# EAGLE design NMEA-v8.2-iso (EAGLE 6.4)
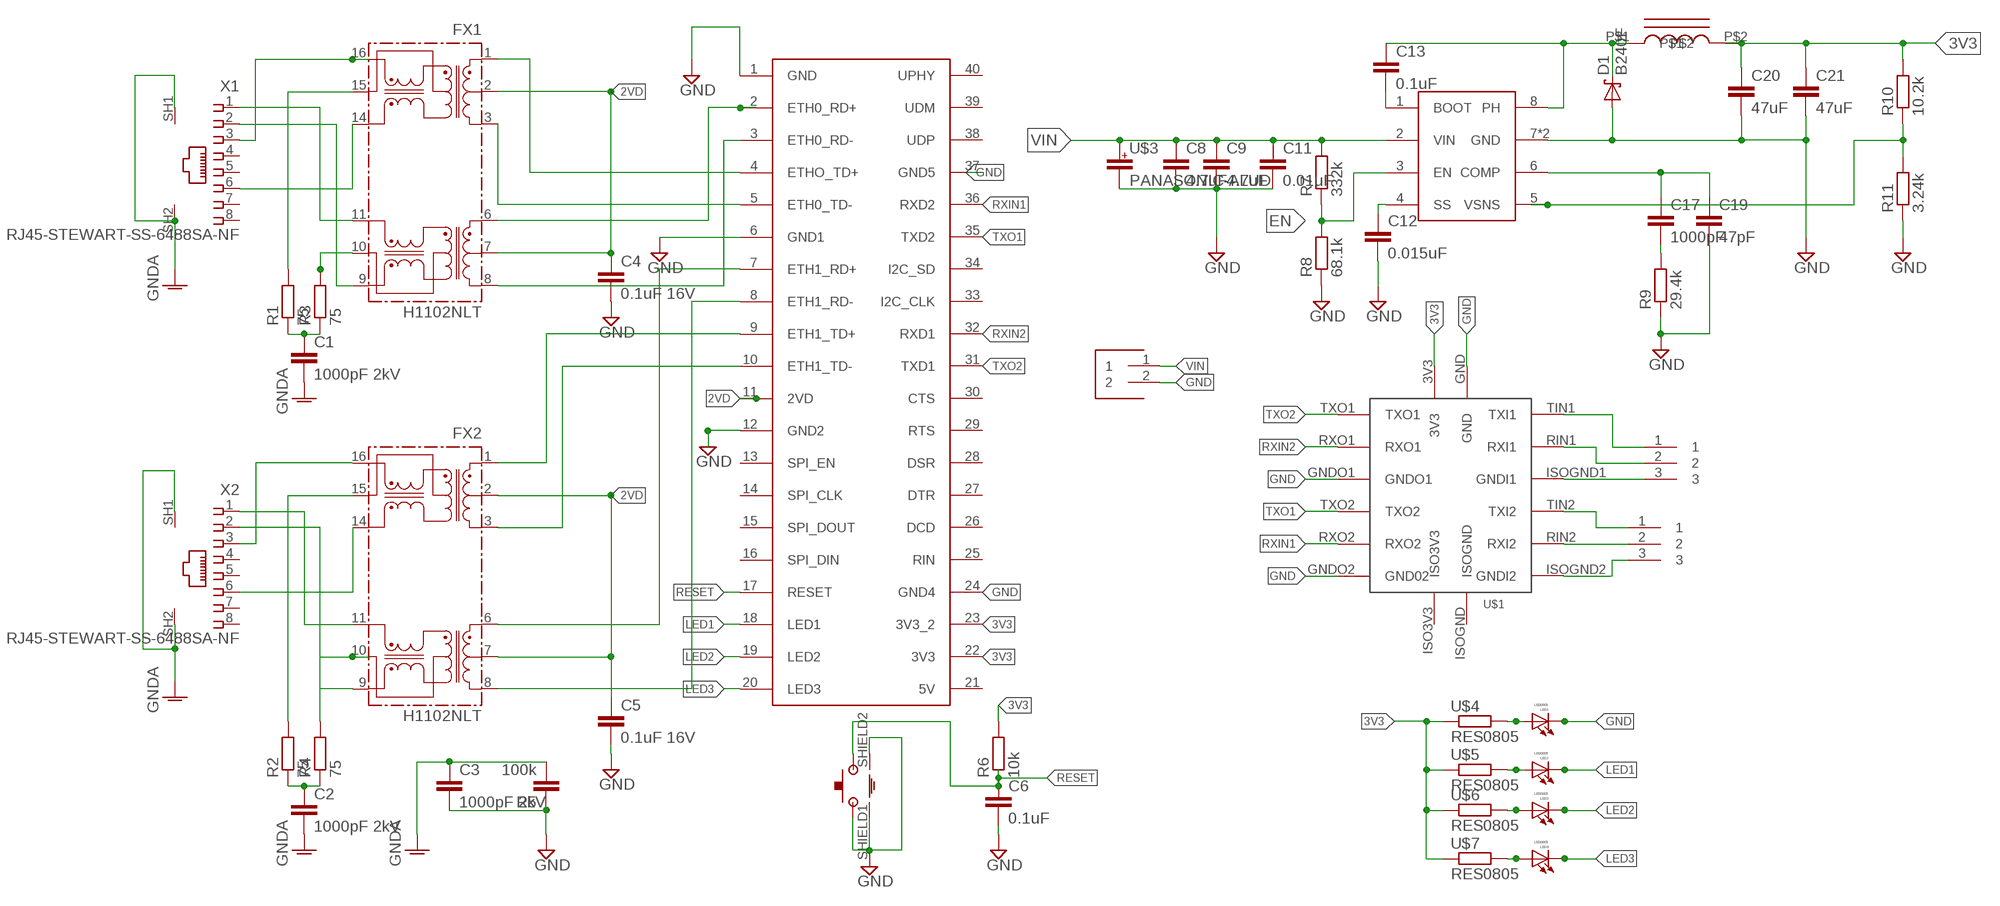
[diagram p0: schematic, sheet 1]

## Parts
C1  1000pF 2kV  CAP1206  [1206]
C2  1000pF 2kV  CAP1206  [1206]
C3  1000pF 2kV  CAP1206  [1206]
C4  0.1uF 16V  CAP0805  [0805]
C5  0.1uF 16V  CAP0805  [0805]
C6  0.1uF  CAP0805  [0805]
C8  4.7uF  CAP1210  [1210]
C9  4.7uF  CAP1210  [1210]
C11  0.01uF  CAP0805  [0805]
C12  0.015uF  CAP0805  [0805]
C13  0.1uF  CAP0805  [0805]
C17  1000pF  CAP0805  [0805]
C19  47pF  CAP0805  [0805]
C20  47uF  CAP1206  [1206]
C21  47uF  CAP1206  [1206]
CARAMBOLA  CARAMBOLA  [CARAMBOLA]
D1  B240F  [SMB]
DATA1  CON-3  [CON-3]
DATA2  CON-3  [CON-3]
FX1  H1102NLT  [H/HX1XXXNL]
FX2  H1102NLT  [H/HX1XXXNL]
J1  CON-5MM-2  [CON--5MM-2]
L1  CLF_TDK_INDUCTORCLF10040  [CLF10040]
LED1  LED0805  [L0805]
LED2  LED0805  [L0805]
LED3  LED0805  [L0805]
LED4  LED0805  [L0805]
R1  75  RES0805  [0805]
R2  75  RES0805  [0805]
R3  75  RES0805  [0805]
R4  75  RES0805  [0805]
R5  100k  CAP1206  [1206]
R6  10k  RES0805  [0805]
R7  332k  RES0805  [0805]
R8  68.1k  RES0805  [0805]
R9  29.4k  RES0805  [0805]
R10  10.2k  RES0805  [0805]
R11  3.24k  RES0805  [0805]
U8  TPS54231  [SOIC-THERMAL]
U$1  ISO-BOARDV1  [ISO-BOARD]
U$2  TACTILE-SWITCH-FSMRA1J  [TACTILE-SWITCH-FSMRA1J]
U$3  PANASONIC-ALUD  [PANASONIC_D]
U$4  RES0805  [0805]
U$5  RES0805  [0805]
U$6  RES0805  [0805]
U$7  RES0805  [0805]
X1  RJ45-STEWART-SS-6488SA-NF  [RJ45-STEWART-6488]
X2  RJ45-STEWART-SS-6488SA-NF  [RJ45-STEWART-6488]

## Nets
2VD: C4.1 C5.1 CARAMBOLA.11(2VD) FX1.2 FX1.7 FX2.2 FX2.7
3V3: C20.1 C21.1 CARAMBOLA.22(3V3) CARAMBOLA.23(3V3_2) L1.P$2 R6.2 R10.2 U$1.3V3 U$4.1 U$5.1 U$6.1 U$7.1
EN: R7.1 R8.2 U8.3(EN)
ETH1_RD: CARAMBOLA.8(ETH1_RD-) FX2.8
GND: C3.2 C4.2 C5.2 C6.2 C8.2 C9.2 C11.2 C12.2 C19.2 C20.2 C21.2 CARAMBOLA.1(GND) CARAMBOLA.6(GND1) CARAMBOLA.12(GND2) CARAMBOLA.24(GND4) CARAMBOLA.37(GND5) D1.A J1.2 LED1.C R5.1 R8.1 R9.1 R11.1 U8.7(GND) U8.P$1(GND) U$1.GND U$1.GNDO1 U$1.GNDO2(GND02) U$2.2 U$2.SHIELD1 U$2.SHIELD2 U$3.-
GNDA: C1.2 C2.2 C3.1 R5.2 X1.SH1 X1.SH2 X2.SH1 X2.SH2
ISOGND1: DATA1.3 U$1.ISOGND1(GNDI1)
ISOGND2: DATA2.3 U$1.ISOGND2(GNDI2)
LED1: CARAMBOLA.18(LED1) LED2.C
LED2: CARAMBOLA.19(LED2) LED3.C
LED3: CARAMBOLA.20(LED3) LED4.C
N$1: CARAMBOLA.4(ETHO_TD+) FX1.1
N$2: C13.2 U8.1(BOOT)
N$3: LED1.A U$4.2
N$4: LED2.A U$5.2
N$5: LED3.A U$6.2
N$6: R10.1 R11.2 U8.5(VSNS)
N$7: C17.1 C19.1 U8.6(COMP)
N$8: C17.2 R9.2
N$9: LED4.A U$7.2
N$11: CARAMBOLA.2(ETH0_RD+) FX1.6
N$13: CARAMBOLA.5(ETH0_TD-) FX1.3
N$16: CARAMBOLA.3(ETH0_RD-) FX1.8
N$17: C2.1 R2.1 R4.1
N$20: FX1.10 R3.2
N$21: FX1.15 R1.2
N$22: C1.1 R1.1 R3.1
N$23: FX1.11 X1.1
N$24: FX1.9 X1.2
N$25: FX1.16 X1.3
N$26: FX1.14 X1.6
N$27: CARAMBOLA.7(ETH1_RD+) FX2.6
N$28: CARAMBOLA.9(ETH1_TD+) FX2.1
N$30: CARAMBOLA.10(ETH1_TD-) FX2.3
N$31: FX2.15 R2.2
N$32: FX2.10 R4.2
N$33: FX2.16 X2.3
N$34: FX2.11 X2.1
N$35: FX2.14 X2.6
N$36: FX2.9 X2.2
PH: C13.1 D1.C L1.P$1 U8.8(PH)
RESET: C6.1 CARAMBOLA.17(RESET) R6.1 U$2.1
RIN1: DATA1.2 U$1.RIN1(RXI1)
RIN2: DATA2.2 U$1.RIN2(RXI2)
RXIN1: CARAMBOLA.36(RXD2) U$1.RXO2
RXIN2: CARAMBOLA.32(RXD1) U$1.RXO1
SS: C12.1 U8.4(SS)
TIN1: DATA1.1 U$1.TIN1(TXI1)
TIN2: DATA2.1 U$1.TIN2(TXI2)
TXO1: CARAMBOLA.35(TXD2) U$1.TXO2
TXO2: CARAMBOLA.31(TXD1) U$1.TXO1
VIN: C8.1 C9.1 C11.1 J1.1 R7.2 U8.2(VIN) U$3.+
Unconnected: CARAMBOLA.13(SPI_EN) CARAMBOLA.14(SPI_CLK) CARAMBOLA.15(SPI_DOUT) CARAMBOLA.16(SPI_DIN) CARAMBOLA.21(5V) CARAMBOLA.25(RIN) CARAMBOLA.26(DCD) CARAMBOLA.27(DTR) CARAMBOLA.28(DSR) CARAMBOLA.29(RTS) CARAMBOLA.30(CTS) CARAMBOLA.33(I2C_CLK) CARAMBOLA.34(I2C_SD) CARAMBOLA.38(UDP) CARAMBOLA.39(UDM) CARAMBOLA.40(UPHY) U$1.ISO3V3 U$1.ISOGND X1.4 X1.5 X1.7 X1.8 X2.4 X2.5 X2.7 X2.8

## Library data of the parts
C1-C6 C8 C9 C11-C13 C17 C19-C21 R5 = __bo_caps:CAP
CARAMBOLA = __my:CARAMBOLA
D1 = __my:B240
DATA1 DATA2 = __my:CON-3
FX1 FX2 = __my:H1102NLT
J1 = __my:CON-5MM-2
L1 = __my:CLF_TDK_INDUCTOR
LED1-LED4 = __my:LED: High Luminous Efficacy 3W Warm White LED Emitter Source: http://www.ledengin.com/products/3wLZ/LZ1-00WW03.pdf
R1-R4 R6-R11 U$4-U$7 = __bo_caps:RES
U8 = __my:TPS54231
U$1 = __my:ISO-BOARD
U$2 = __my:TACTILE-SWITCH-FSMRA
U$3 = __bo_caps:PANASONIC-ALU
X1 X2 = __my:RJ45-STEWART-SS-6488S

## Board
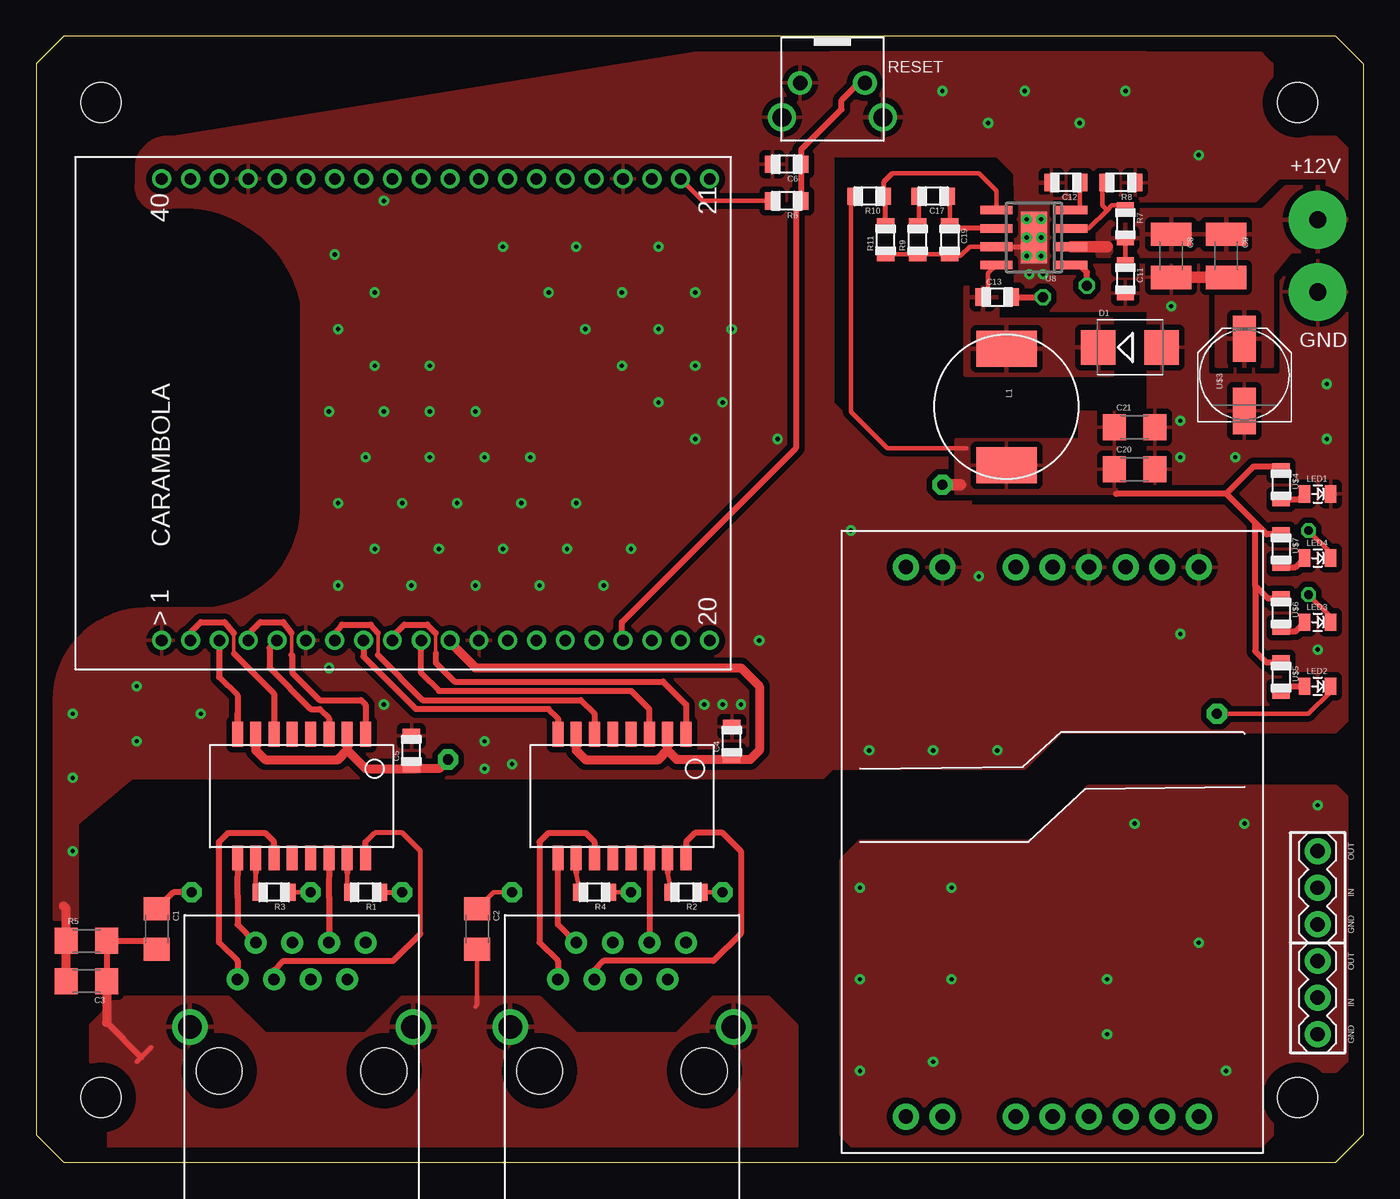
[diagram p1: board, top side]
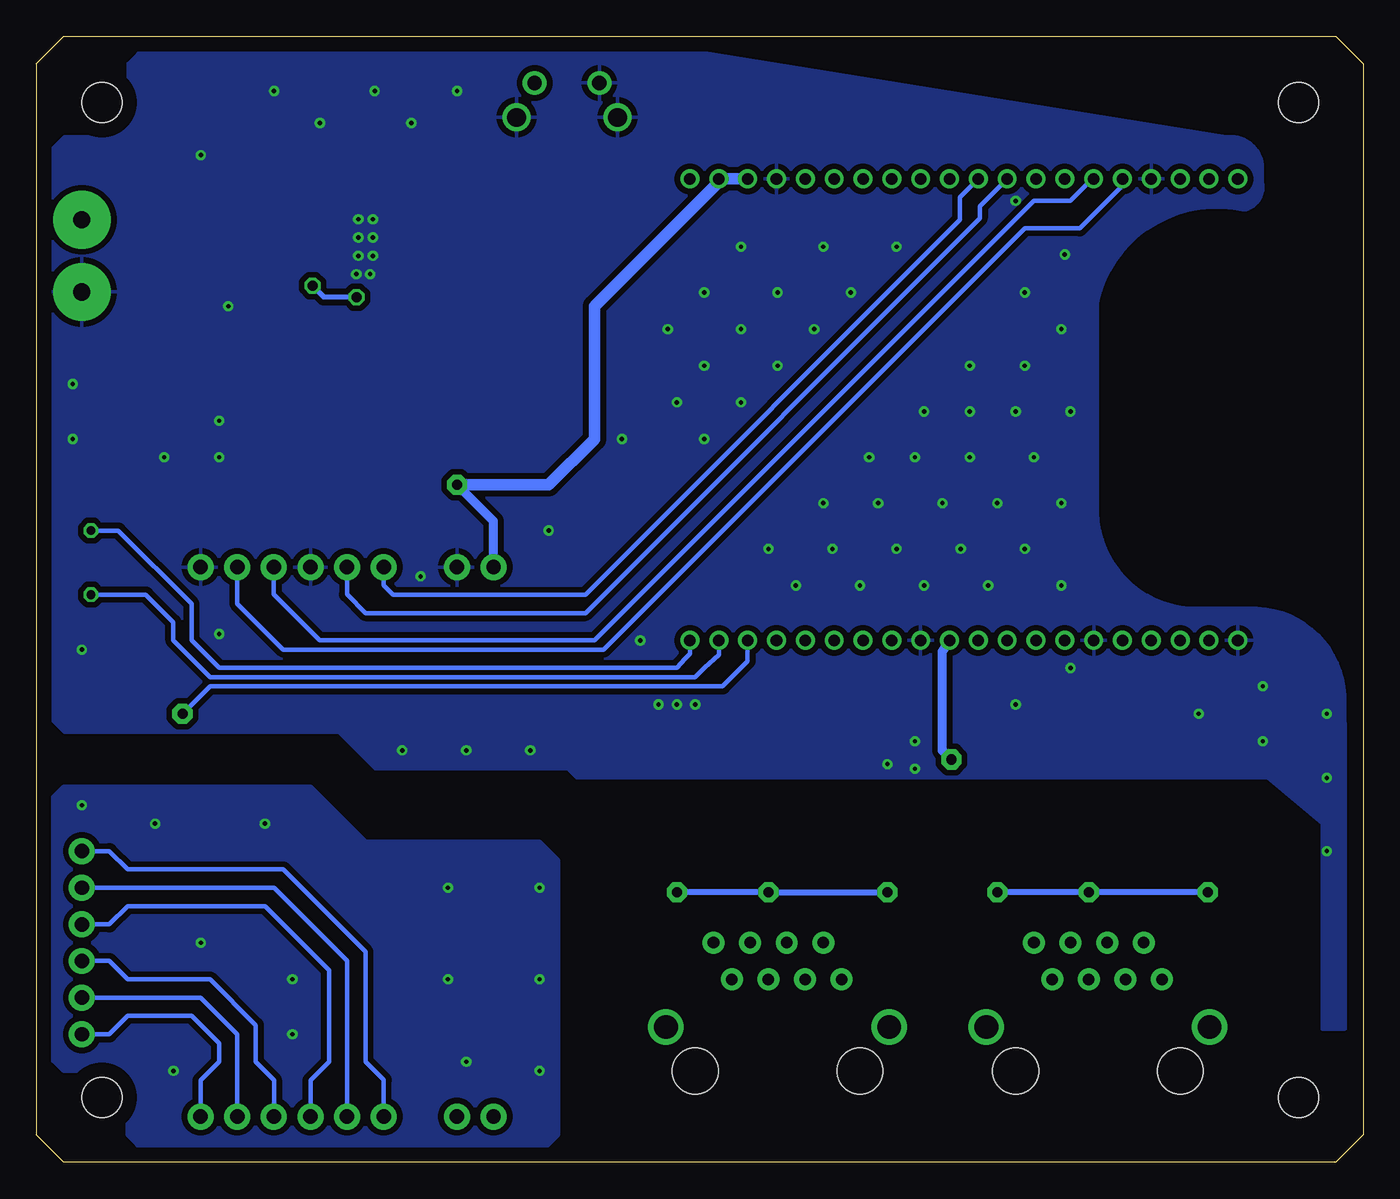
[diagram p2: board, bottom side, seen from below]

Size 92.08 x 78.11 mm. Coordinates in mm from the lower left corner, seen from the top.
Outline: 0,76.2 0,1.91 1.91,0 90.17,0 92.08,1.91 92.08,76.2 90.17,78.11 1.91,78.11 0,76.2
Copper layers (1*16): Top 0.035mm / dielectric 1.5mm / Bottom 0.035mm
Design rules "default *": minimum track width 8mil, minimum drill 10mil, track to track 8mil, track to pad 8mil, pad to pad 8mil, via to via 8mil, smd to smd 8mil, copper to edge 40mil, drill to drill 8mil, minimum pad ring 10mil, minimum via ring 8mil, stop-mask expansion 4mil, vias tented up to drill 0.35mm, thermal gap 16mil
Holes 2.8 mm at 4.5,73.5 87.5,73.5 87.5,4.5 4.5,4.5

### Footprints (pad centres in the part's own frame; a part is rotated, then mirrored left to right if it is on the bottom)
1206 = smd 1.6 x 1.8: 1 -1.4,0.127; 2 1.4,0.127
0805 = smd 1 x 1.2: 1 -1,0; 2 1,0
1210 = smd 1.6 x 2.8: 1 -1.5,0; 2 1.5,0
CARAMBOLA = drill 0.8: 1 -16,19; 2 -16,17; 3 -16,15; 4 -16,13; 5 -16,11; 6 -16,9; 7 -16,7; 8 -16,5; 9 -16,3; 10 -16,1; 11 -16,-1; 12 -16,-3; 13 -16,-5; 14 -16,-7; 15 -16,-9; 16 -16,-11; 17 -16,-13; 18 -16,-15; 19 -16,-17; 20 -16,-19; 21 16,-19; 22 16,-17; 23 16,-15; 24 16,-13; 25 16,-11; 26 16,-9; 27 16,-7; 28 16,-5; 29 16,-3; 30 16,-1; 31 16,1; 32 16,3; 33 16,5; 34 16,7; 35 16,9; 36 16,11; 37 16,13; 38 16,15; 39 16,17; 40 16,19
SMB = smd 2.4 x 2.4: A 2.2,0; C -2.2,0
CON-3 = drill 1 pad 1.8: 1 0,2.54; 2 0,0; 3 0,-2.54
H/HX1XXXNL = smd 0.762 x 1.714: 1 -5.08,-4.286; 2 -3.81,-4.286; 3 -2.54,-4.286; 4 -1.27,-4.286; 5 0,-4.286; 6 1.27,-4.286; 7 2.54,-4.286; 8 3.81,-4.286; 9 3.81,4.286; 10 2.54,4.286; 11 1.27,4.286; 12 0,4.286; 13 -1.27,4.286; 14 -2.54,4.286; 15 -3.81,4.286; 16 -5.08,4.286
CON--5MM-2 = drill 1.2 pad 4: 1 0,2.5; 2 0,-2.5
CLF10040 = smd 2.5 x 4.2: P$1 -4.05,0; P$2 4.05,0
L0805 = smd 0.8 x 1.2: A -0.9,0; C 0.9,0
SOIC-THERMAL = smd 0.6 x 2.2: 1 -1.905,-2.6; 2 -0.635,-2.6; 3 0.635,-2.6; 4 1.905,-2.6; 5 1.905,2.6; 6 0.635,2.6; 7 -0.635,2.6; 8 -1.905,2.6 | smd 3.556 x 1.778: P$1 0,0
ISO-BOARD = drill 1 pad 1.8: 3V3 -10.16,19.05; GND -7.62,19.05; GNDO1 2.54,19.05; GNDO2 10.16,19.05; ISO3V3 -10.16,-19.05; ISOGND -7.62,-19.05; ISOGND1 2.54,-19.05; ISOGND2 10.16,-19.05; RIN1 0,-19.05; RIN2 7.62,-19.05; RXO1 0,19.05; RXO2 7.62,19.05; TIN1 -2.54,-19.05; TIN2 5.08,-19.05; TXO1 -2.54,19.05; TXO2 5.08,19.05
TACTILE-SWITCH-FSMRA1J = drill 0.99 pad 1.651: 1 -2.248,-1.194; 2 2.248,-1.194 | drill 1.3: SHIELD1 -3.505,1.194; SHIELD2 3.505,1.194
PANASONIC_D = smd 3.2 x 1.6: + 2.5,0; - -2.5,0
RJ45-STEWART-6488 = drill 0.8 pad 1.524: 1 -4.445,6.35; 2 -3.175,8.89; 3 -1.905,6.35; 4 -0.635,8.89; 5 0.635,6.35; 6 1.905,8.89; 7 3.175,6.35; 8 4.445,8.89 | drill 1.651: SH1 -7.747,3.048; SH2 7.747,3.048 | hole 3.175: -5.715,0; 5.715,0

### Placement (x,y rotation side)
C1  8.26,16.19 270 top
C2  30.48,16.19 270 top
C3  3.49,12.7 180 top
C4  48.26,29.21 90 top
C5  26.04,28.57 90 top
C6  52.07,69.22 180 top
C8  78.74,62.87 270 top
C9  82.55,62.87 270 top
C11  75.56,61.28 270 top
C12  71.44,67.94 180 top
C13  66.67,60.01 0 top
C17  62.23,66.99 180 top
C19  63.37,63.98 270 top
C20  76.2,47.94 0 top
C21  76.2,50.85 0 top
CARAMBOLA  27.71,52.2 90 top
D1  75.88,56.52 0 top
DATA1  88.9,19.05 0 top
DATA2  88.9,11.43 0 top
FX1  17.78,25.4 180 top
FX2  40.01,25.4 180 top
J1  88.9,62.87 0 top
L1  67.31,52.39 270 top
LED1  88.9,46.35 0 top
LED2  88.9,33.02 0 top
LED3  88.9,37.47 0 top
LED4  88.9,41.91 0 top
R1  22.86,18.73 180 top
R2  45.09,18.73 180 top
R3  16.51,18.73 180 top
R4  38.73,18.73 180 top
R5  3.49,15.24 0 top
R6  52.07,66.67 180 top
R7  75.56,65.09 270 top
R8  75.25,67.94 180 top
R9  61.15,63.98 90 top
R10  57.78,66.99 180 top
R11  58.93,63.98 90 top
U8  69.22,64.14 90 top
U$1  70.5,22.23 0 top
U$2  55.24,73.66 180 top
U$3  83.82,54.61 90 top
U$4  86.36,46.99 270 top
U$5  86.36,33.66 270 top
U$6  86.36,38.1 270 top
U$7  86.36,42.55 270 top
X1  18.41,6.35 0 top
X2  40.64,6.35 0 top

### Tracks (layer width: path | path; a pad name or v marks a point on that pad's centre or on a via)
2VD  (via drill 0.7 pad 1.4)
  Top 0.305: FX2.2 43.81,29.21
  Top 0.356: FX2.7 37.47,29.21
  Top 0.61: v28.57,27.94 27.94,27.3 26.4,27.3 | 43.81,28.57 FX2.2 | 37.47,29.21 37.47,28.57 38.1,27.94 43.18,27.94 43.81,28.57 | 43.81,28.57 44.45,27.94 48.53,27.94 | FX1.7 15.24,28.57 15.88,27.94 20.95,27.94 21.59,28.57 | FX1.2 21.59,28.57 | 21.59,28.57 22.86,27.3 26.04,27.3 | 26.04,27.3 26.4,27.3 | 26.4,27.3 C5.1 26.04,27.3 | CARAMBOLA.11 28.71,36.05 30.48,34.29 48.9,34.29 50.16,33.02 50.16,28.57 49.53,27.94 48.53,27.94 | 48.53,27.94 C4.1
  Bottom 0.61: v28.57,27.94 29.21,28.57 29.21,35.43 CARAMBOLA.11
3V3  (via drill 0.7 pad 1.4)
  Top 0.254: L1.P$2 67.31,49.53
  Top 0.305: 64.53,49.53 59.05,49.53 56.52,52.07 56.52,67.31 56.78,67.04 R10.2 56.78,66.63 | CARAMBOLA.22 46.24,66.67 R6.2
  Top 0.406: 85.94,39.37 U$6.1 85.47,39.1 84.56,40.01 | U$4.1 86.09,48.26 84.45,48.26 82.55,46.35 | 82.55,46.35 74.93,46.35 | U$7.1 85.36,43.55 84.56,44.34 | U$5.1 85.36,34.66 84.56,35.45 84.56,40.01 | 84.56,44.34 82.55,46.35 | 84.56,40.01 84.56,44.34
  Top 0.813: 64.14,46.99 v62.87,46.99
  Bottom 0.61: U$1.3V3 60.34,44.47 v62.87,46.99
  Bottom 0.813: CARAMBOLA.23 CARAMBOLA.22 44.72,68 53.34,59.37 53.34,50.16 56.52,46.99 v62.87,46.99
  pour Top (isolate 0.406): 74.93,46.35 63.82,46.35 63.82,50.16 72.39,50.16 72.39,52.07 74.93,52.07
EN
  Top 0.305: U8.3 73.03,64.77 74.3,66.04 | 74.3,66.04 73.98,66.36 73.98,67.9 R8.2 | 74.3,66.04 74.61,66.36 75.3,66.36 R7.1
ETH1_RD
  Top 0.406: FX2.8 36.2,30.8 35.56,31.43 26.35,31.43 22.71,35.07 CARAMBOLA.8
GND  (via drill 0.3)
  Top 0.305: U8.7 64.77,63.5 64.14,62.87 63.95,62.87 C19.2 R9.1 R11.1
  Top 0.356: U8.7 69.22,63.5 U8.P$1
  Top 0.61: C3.2 R5.1 2.09,17.59 1.91,17.78
  Top 0.813: C8.2 C9.2
  other vias: 89.53,50.16 51.44,50.16 6.99,29.21 22.86,48.9 31.11,27.3 11.43,31.11 50.16,36.2 79.38,36.64 56.52,43.81 57.78,28.57 24.13,31.75 20.32,34.29 62.87,74.3 68.58,74.3 75.56,74.3 79.38,51.44 89.53,53.98 83.19,48.9 27.3,48.9 31.11,48.9 34.29,48.9 25.4,45.72 29.21,45.72 33.66,45.72 37.47,45.72 24.13,52.07 27.3,52.07 27.3,55.24 23.5,55.24 23.5,60.33 20.95,57.78 20.32,52.07 20.95,45.72 23.5,42.55 27.94,42.55 32.38,42.55 36.83,42.55 35.56,60.33 40.64,60.33 45.72,60.33 38.1,57.78 43.18,57.78 48.26,57.78 32.38,63.5 37.47,63.5 43.18,63.5 68.71,65.41 69.72,65.41 68.71,64.14 68.71,62.87 69.72,64.14 69.72,62.87 30.48,52.07 40.64,55.24 45.72,55.24 43.18,52.7 47.62,52.7 45.72,50.16 20.95,40.01 26.04,40.01 30.48,40.01 34.92,40.01 39.37,40.01 41.27,42.55 2.54,21.59 6.99,33.02 2.54,31.11 79.38,48.9 65.41,40.64 66.67,28.57 20.72,62.96 24.13,66.67 62.23,28.57 88.9,35.56 31.11,29.21 47.62,31.75 46.35,31.75 80.64,69.85 66.04,72.07 72.39,72.07 68.9,61.59 69.85,61.59 78.74,59.37 48.9,31.75 2.54,26.67 33.02,27.62
  pour Top (isolate 0.406): 70.04,67.78 70.04,69.85 74.93,69.85 76.83,71.75 76.83,77.47 55.24,77.47 55.24,69.85 66.67,69.85 67.94,68.58 67.94,67.78
  pour Top (isolate 0.406, rank 2): 67.94,77.47 84.45,77.47 85.72,76.2 85.72,72.39 87,71.12 90.17,71.12 91.44,69.85 91.44,44.22 77.15,44.22 77.15,59.05 67.94,59.05
  pour Top (isolate 0.406): 4.45,34.92 4.45,26.67 50.16,26.67 50.16,34.92
  pour Bottom (isolate 0.406): 1.27,26.67 1.27,32.38 arc-90 7.94,38.42 11.43,38.42 arc90 18.41,45.09 18.41,59.69 arc90 8.26,66.04 arc-90 6.99,67.94 6.99,69.22 arc-90 9.53,71.12 48.9,77.47 84.45,77.47 85.72,76.2 85.72,72.39 87,71.12 90.17,71.12 91.44,69.85 91.44,31.11 90.17,29.84 71.12,29.84 68.58,27.3 55.24,27.3 54.61,26.67
  pour Bottom (isolate 0.61): 1.27,30.48 1.27,9.21 2.86,9.21 2.86,23.5 6.67,26.67 9.21,28.57 8.26,30.48
  pour Top (isolate 0.406, rank 2): 9.53,71.12 48.9,77.47 55.24,77.47 55.24,52.7 59.05,48.9 64.77,48.9 65.09,27.3 55.24,27.3 54.61,26.67 12.38,26.67 9.21,28.57 6.67,26.67 2.86,23.5 2.86,16.83 1.27,16.83 1.27,32.07 arc-90 7.62,38.42 11.75,38.42 arc90 18.41,45.72 18.41,59.69 arc90 8.26,66.04 arc-90 6.99,67.94 6.99,69.22 arc-90
  pour Top (isolate 0.406, rank 2): 91.44,45.53 91.44,31.11 90.17,29.84 71.12,29.84 68.58,27.3 55.24,27.3 53.98,28.57 53.98,45.53
  pour Top (isolate 0.406, no thermals): 67.94,66.99 67.94,60.96 70.48,60.96 70.48,66.99
GNDA
  Top 0.305: 7.99,7.99 7.3,7.3 6.99,6.99 | 30.48,10.79 30.61,10.92 C2.2
  Top 0.406: C3.1 R5.2 7.81,15.37 C1.2 | 4.89,9.71 7.3,7.3
  Top 0.61: C3.1 4.89,9.71
  pour Top (isolate 0.305, rank 3): 5.71,11.43 13.34,11.43 15.88,8.89 22.86,8.89 25.4,11.43 34.92,11.43 37.47,8.89 44.45,8.89 46.99,11.43 50.8,11.43 52.7,9.53 52.7,0.64 5.08,0.64 5.08,5.71 3.81,6.99 3.81,9.53
ISOGND  (via drill 0.3)
  other vias: 57.15,19.05 63.5,19.05 88.9,24.77 63.5,12.7 57.15,12.7 57.15,6.35 62.23,6.99 74.3,8.89 74.3,12.7 80.64,15.24 83.82,23.5 76.2,23.5 82.55,6.35
  pour Top (isolate 0.406): 55.88,20.95 57.15,22.23 69.22,22.23 73.03,26.04 90.17,26.04 91.44,24.77 91.44,7.62 90.17,6.35 87,6.35 85.72,5.08 85.72,1.91 84.45,0.64 57.15,0.64 55.88,1.91
  pour Bottom (isolate 0.406): 55.88,1.91 57.15,0.64 84.45,0.64 85.72,1.91 85.72,5.08 87,6.35 90.17,6.35 91.44,7.62 91.44,24.77 90.17,26.04 73.03,26.04 69.22,22.23 57.15,22.23 55.88,20.95
ISOGND1
  Bottom 0.305: DATA1.3 87,16.51 85.72,17.78 76.2,17.78 71.75,13.34 71.75,6.99 73.04,5.7 U$1.ISOGND1
ISOGND2
  Bottom 0.305: DATA2.3 87,8.89 85.72,10.16 81.28,10.16 79.38,8.26 79.38,6.99 80.66,5.7 U$1.ISOGND2
LED1  (via drill 0.7 pad 1.4)
  Top 0.305: v81.92,31.11 88.27,31.11 89.8,32.65 LED2.C
  Bottom 0.305: v81.92,31.11 80.01,33.02 44.45,33.02 42.72,34.76 CARAMBOLA.18
LED2  (via drill 0.6)
  Top 0.305: 89.8,37.2 LED3.C 89.8,37.84 v88.27,39.37
  Bottom 0.305: CARAMBOLA.19 44.72,35.19 45.72,34.29 46.35,33.66 80.01,33.66 82.55,36.2 82.55,37.47 84.45,39.37 v88.27,39.37
LED3  (via drill 0.6)
  Top 0.305: 89.8,41.65 LED4.C | 89.8,42.28 v88.27,43.81
  Top 0.406: LED4.C 89.8,42.28
  Bottom 0.305: CARAMBOLA.20 46.72,35.28 47.08,34.92 47.62,34.29 79.38,34.29 81.28,36.2 81.28,38.73 86.36,43.81 v88.27,43.81
N$1
  Top 0.254: 17.71,36.7 17.71,35.2
  Top 0.406: CARAMBOLA.4 14.92,36.83 15.56,37.47 17.14,37.47 17.71,36.7 | 17.71,35.2 17.78,35.14 17.78,33.97 19.68,32.07 22.54,32.07 22.86,31.75 FX1.1
N$2  (via drill 0.7)
  Top 0.305: 72.39,62.23 U8.1
  Top 0.406: C13.2 v69.85,60.01 | v72.9,60.8 72.9,61.72 72.39,62.23
  Bottom 0.356: v72.9,60.8 72.11,60.01 v69.85,60.01
N$3
  Top 0.406: U$4.2 87.64,45.99 LED1.A
N$4
  Top 0.406: U$5.2 86.58,33.02 LED2.A
N$5
  Top 0.406: U$6.2 86.58,36.83 87.36,36.83 LED3.A
N$6
  Top 0.305: U8.5 66.61,67.37 65.41,68.58 59.41,68.58
  Top 0.356: R11.2 58.93,66.94 R10.1 58.83,68 59.41,68.58
N$7
  Top 0.305: C17.1 63.37,66.73 C19.1
  Top 0.356: U8.6 63.11,64.77 C19.1
N$8
  Top 0.305: C17.2 61.23,65.06 R9.2
N$9
  Top 0.406: U$7.2 86.36,41.27 87.36,41.27 LED4.A
N$11
  Top 0.254: 13.71,36.7 13.71,35.31
  Top 0.305: CARAMBOLA.2 10.79,36.2
  Top 0.406: 10.79,36.2 10.79,36.83 11.43,37.47 13.08,37.47 13.71,36.7 | 13.71,35.31 16.51,32.51 FX1.6
N$13
  Top 0.406: FX1.3 20.32,30.8 19.68,31.43 19.05,31.43 16.19,34.29 16.19,35.68 CARAMBOLA.5
N$16
  Top 0.406: FX1.8 13.97,30.48 | 13.97,30.48 13.97,31.11 | CARAMBOLA.3 12.7,33.66 13.97,32.38 13.97,30.48
N$17  (via drill 0.7 pad 1.4)
  Top 0.305: v33.02,18.73 31.75,18.73 C2.1 | v41.27,18.73 R4.1 | v47.62,18.73 R2.1
  Bottom 0.406: v33.02,18.73 v41.27,18.73 v47.62,18.73
N$20
  Top 0.305: 15.24,20.11 15.24,19.05 15.51,18.78 R3.2
  Top 0.406: FX1.10 15.24,20.11
N$21
  Top 0.305: 21.59,20.11 21.59,19.05 21.86,18.78 R1.2
  Top 0.406: FX1.15 21.59,20.11
N$22  (via drill 0.7 pad 1.4)
  Top 0.305: R3.1 v19.05,18.73 | v10.79,18.73
  Top 0.356: R1.1 v25.4,18.73
  Top 0.406: v10.79,18.73 9.52,18.73 C1.1
  Bottom 0.406: v25.4,18.73 v19.05,18.73 v10.79,18.73
N$23
  Top 0.406: FX1.11 16.51,22.23 15.88,22.86 13.34,22.86 12.7,22.23 12.7,15.24 13.97,13.97 X1.1
N$24
  Top 0.406: FX1.9 13.96,18.65 13.97,18.41 13.97,16.51 X1.2
N$25
  Top 0.356: 22.86,22.23 23.5,22.86 25.4,22.86 26.67,21.59 26.67,15.88
  Top 0.406: FX1.16 22.86,22.23 | X1.3 16.51,13.34 17.14,13.97 24.77,13.97 26.67,15.88
N$26
  Top 0.406: FX1.14 20.31,18.37 20.32,18.41 X1.6
N$27
  Top 0.254: 23.71,36.7 23.71,35.18
  Top 0.406: FX2.6 38.73,31.11 37.78,32.07 26.83,32.07 23.71,35.18 | CARAMBOLA.7 20.71,36.7 21.21,37.29 23.21,37.29 23.71,36.7
N$28
  Top 0.254: 27.71,36.7 27.71,35.29
  Top 0.406: CARAMBOLA.9 24.77,36.51 25.54,37.29 27.13,37.29 27.71,36.7 | FX2.1 45.09,31.75 43.5,33.34 29.03,33.34 27.71,34.65 27.71,35.29
N$30
  Top 0.406: FX2.3 42.55,31.43 41.27,32.7 27.94,32.7 26.71,33.93 CARAMBOLA.10
N$31
  Top 0.305: 43.81,20.11 R2.2
  Top 0.406: FX2.15 43.81,20.11
N$32
  Top 0.305: 37.47,20.11 R4.2
  Top 0.406: FX2.10 37.47,20.11
N$33
  Top 0.406: FX2.16 45.09,22.23 45.72,22.86 47.62,22.86 48.9,21.59 48.9,15.88 46.99,13.97 39.37,13.97 38.73,13.34 X2.3
N$34
  Top 0.406: FX2.11 38.73,22.23 38.1,22.86 35.56,22.86 34.92,22.23 34.92,15.24 36.2,13.97 X2.1
N$35
  Top 0.406: FX2.14 X2.6
N$36
  Top 0.406: FX2.9 36.2,16.51 X2.2
PH
  Top 0.305: 67.59,56.52 L1.P$1 | U8.8 66.04,61.66 66.04,60.01 C13.1
  pour Top (isolate 0.406): 66.67,60.64 66.67,58.42 74.61,58.42 74.61,54.61 64.45,54.61 64.45,60.64
RESET
  Top 0.406: CARAMBOLA.17 40.64,36.28 40.64,37.47 52.7,49.53 52.7,66.41 R6.1 C6.1 53.07,70.22 55.88,73.03 55.88,73.66 57.07,74.85 U$2.1
RIN1
  Bottom 0.305: DATA1.2 75.56,19.05 70.5,13.98 U$1.RIN1
RIN2
  Bottom 0.305: U$1.RIN2 78.12,8.9 80.64,11.43 DATA2.2
RXIN1
  Bottom 0.305: U$1.RXO2 78.12,38.75 74.93,35.56 52.7,35.56 23.5,64.77 19.68,64.77 16.71,67.74 CARAMBOLA.36
RXIN2
  Bottom 0.305: U$1.RXO1 70.5,39.38 69.22,38.1 53.98,38.1 26.62,65.45 26.62,66.3 CARAMBOLA.32
SS
  Top 0.305: U8.4 72.39,66.04 72.39,67.04 C12.1
TIN1
  Bottom 0.305: DATA1.1 87,21.59 85.72,20.32 74.93,20.32 69.22,14.61 69.22,6.99 67.96,5.73 U$1.TIN1
TIN2
  Bottom 0.305: DATA2.1 87,13.97 85.72,12.7 80.01,12.7 76.83,9.53 76.83,6.99 75.56,5.71 75.56,3.19 U$1.TIN2
TXO1
  Bottom 0.305: 18.79,68.2 20.32,66.67 22.86,66.67 53.34,36.2 72.39,36.2 75.58,39.38 U$1.TXO2
  Bottom 0.406: CARAMBOLA.35 18.79,68.2
TXO2
  Bottom 0.305: U$1.TXO1 67.96,40.02 67.31,39.37 53.98,39.37 27.98,65.36 27.98,66.94 CARAMBOLA.31
VIN
  Top 0.305: C11.1 R7.2
  Top 0.813: U8.2 74.3,63.5
  pour Top (isolate 0.406): 73.66,62.87 73.66,66.04 85.09,66.04 86.68,67.63 91.44,67.63 91.44,63.18 87,63.18 85.72,61.59 85.72,55.24 81.92,55.24 81.92,62.87

### Text on the board
tPlace: RESET | +12V | GND | OUT | IN | GND | OUT | IN | GND
DrillLegend_01-16: 01-16
DrillLegend_01-20: 01-20